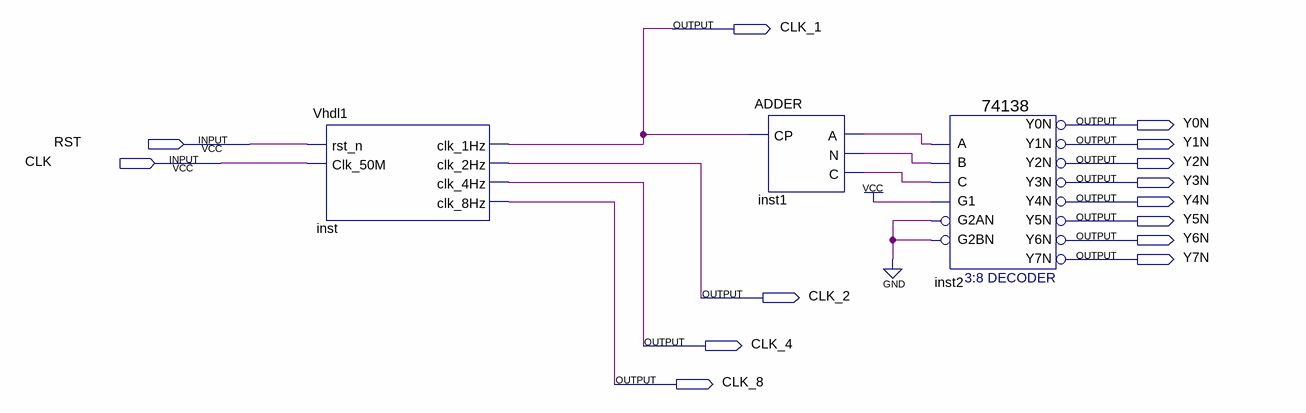
[diagram p0: schematic sheet]
// Quartus schematic Block1.bdf as structural Verilog: 3 symbols, 14 pins
module Block1 (
  input  RST,
  input  CLK,
  output CLK_1,
  output Y0N,
  output Y1N,
  output Y2N,
  output Y3N,
  output Y4N,
  output Y5N,
  output Y6N,
  output Y7N,
  output CLK_2,
  output CLK_4,
  output CLK_8
);

  wire inst1_a, inst1_c, inst1_n;

  Vhdl1 inst (.rst_n(RST), .Clk_50M(CLK), .clk_1Hz(CLK_1), .clk_2Hz(CLK_2), .clk_4Hz(CLK_4), .clk_8Hz(CLK_8));
  ADDER inst1 (.CP(CLK_1), .A(inst1_a), .N(inst1_n), .C(inst1_c));
  \74138  inst2 (
    .A(inst1_a), .B(inst1_n), .G1(1'b1), .C(inst1_c), .G2AN(1'b0), .G2BN(1'b0), .Y0N(Y0N), .Y1N(Y1N),
    .Y2N(Y2N), .Y3N(Y3N), .Y4N(Y4N), .Y5N(Y5N), .Y6N(Y6N), .Y7N(Y7N));
endmodule
